# EAGLE schematic v1 (EAGLE 7.5.0)
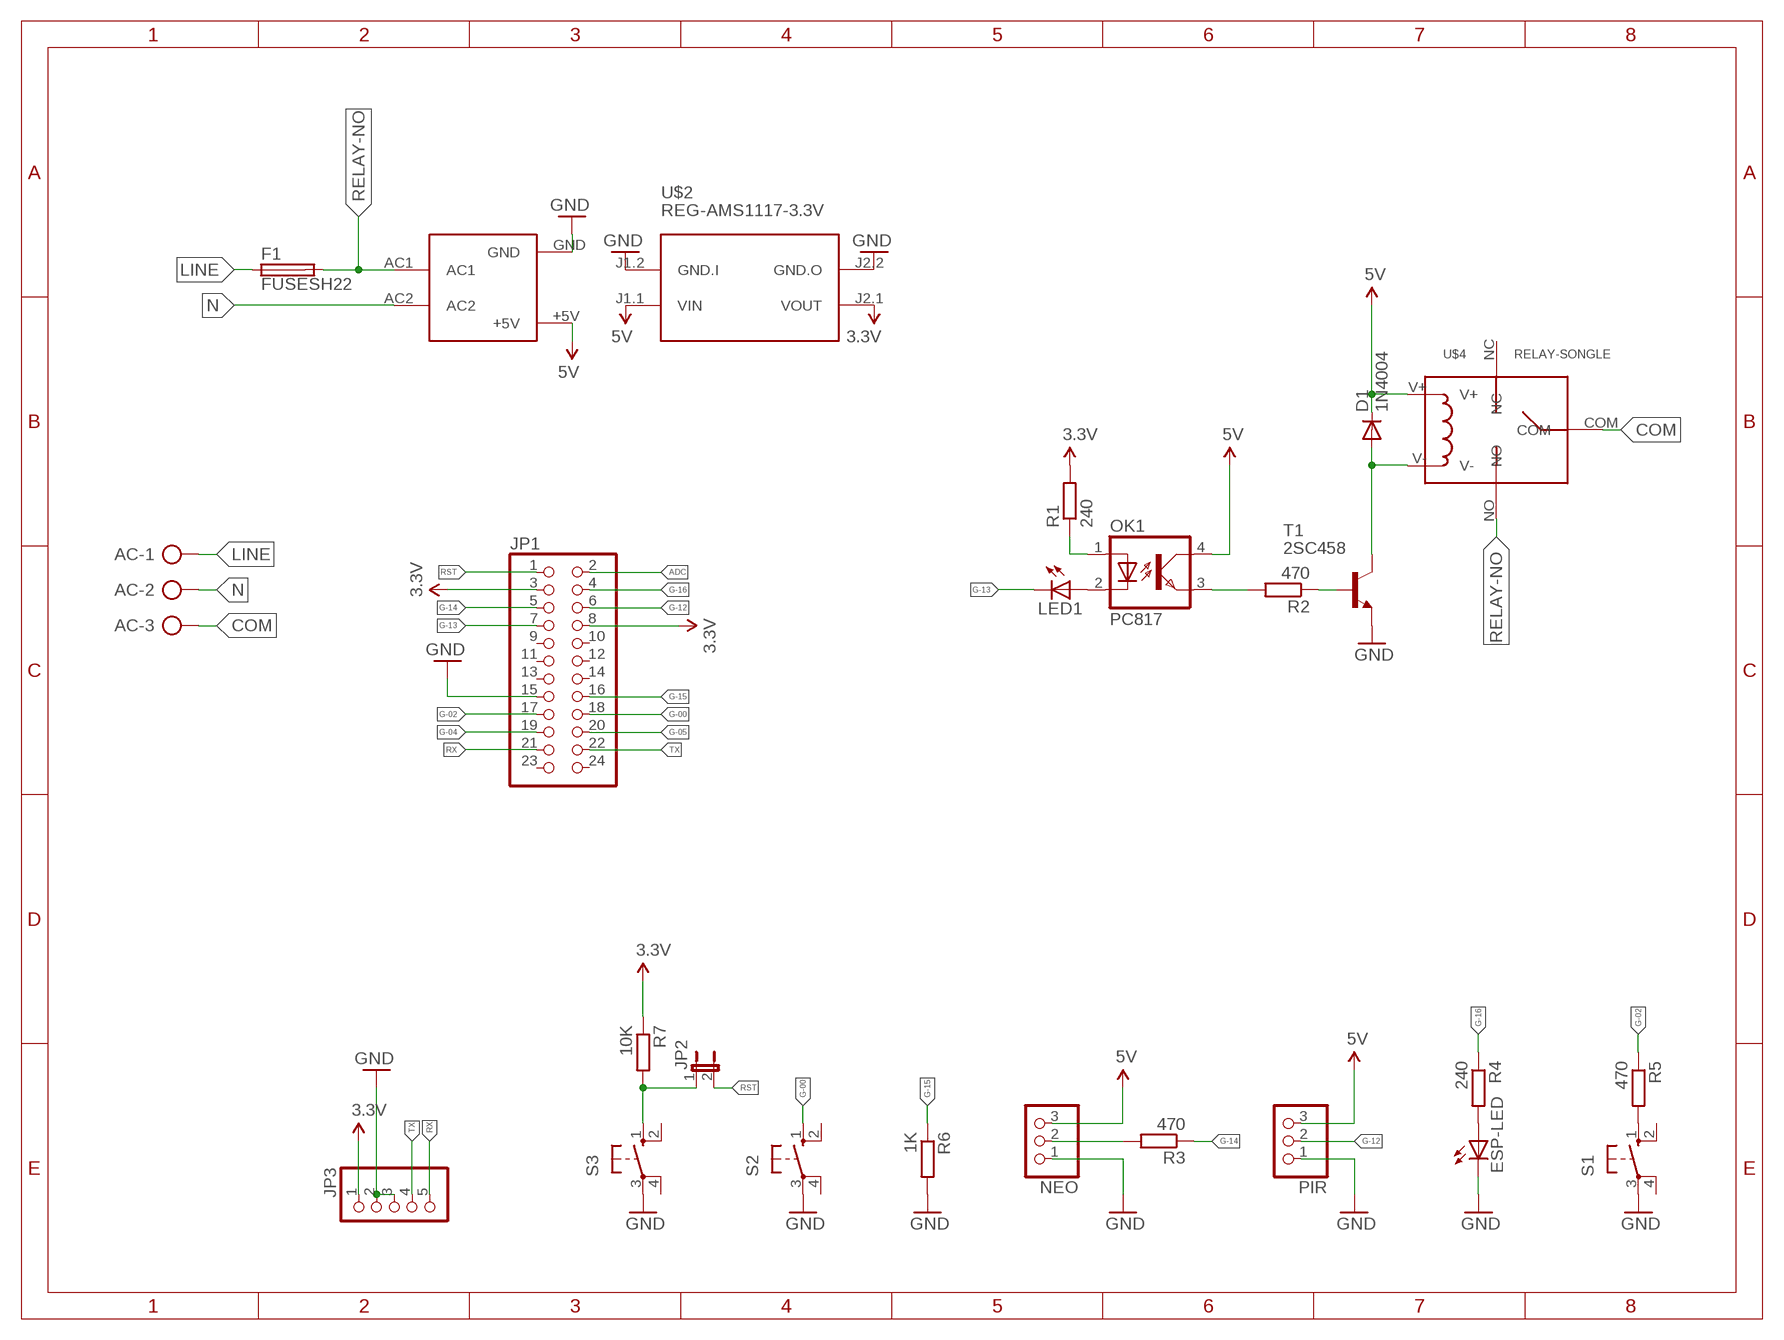
[diagram p0: schematic, sheet 1]

## Parts
AC  AK300/3  [AK300/3]
D1  1N4004  [DO41-10]
ESP-LED  LED5MM  [LED5MM]
F1  FUSESH22  [SH22]
JP1  PINHD-2X12  [2X12]
JP2  JUMPER-2PTH  [1X02]
JP3  PINHD-1X5  [1X05]
LED1  LED5MM  [LED5MM]
NEO  PINHD-1X3  [1X03]
OK1  PC817  [DIL04]
PIR  PINHD-1X3  [1X03]
R1  240  R-EU_0204/5  [0204/5]
R2  470  R-EU_0204/5  [0204/5]
R3  470  R-EU_0204/5  [0204/5]
R4  240  R-EU_0204/5  [0204/5]
R5  470  R-EU_0204/5  [0204/5]
R6  1K  R-EU_0204/5  [0204/5]
R7  10K  R-EU_0204/5  [0204/5]
S1  10-XX  [B3F-10XX]
S2  10-XX  [B3F-10XX]
S3  10-XX  [B3F-10XX]
T1  2SC458  [TO92-ECB]
U$1  HLK-PM01  [HLK-PM01]
U$2  REG-AMS1117-3.3V  [REG-AMS1117]
U$4  RELAY-SONGLE  [RELAY-SONGLE]

## Nets
3.3V: JP1.3 JP1.8 JP3.1 R1.2 R7.1 U$2.J2.1(VOUT)
5V: D1.C NEO.3 OK1.4(COL) PIR.3 U$1.+5V U$2.J1.1(VIN) U$4.V+
ADC: JP1.2
COM: AC.3 U$4.COM
G-00: JP1.18 S2.1(S)
G-02: JP1.17 R5.1
G-04: JP1.19
G-05: JP1.20
G-12: JP1.6 PIR.2
G-13: JP1.7 LED1.K(C)
G-14: JP1.5 R3.1
G-15: JP1.16 R6.1
G-16: JP1.4 R4.1
GND: ESP-LED.K(C) JP1.15 JP3.2 JP3.3 NEO.1 PIR.1 R6.2 S1.3(P) S2.3(P) S3.3(P) T1.E U$1.GND U$2.J1.2(GND.I) U$2.J2.2(GND.O)
LINE: AC.1 F1.1
N: AC.2 U$1.AC2
N$1: LED1.A OK1.2(C)
N$2: OK1.1(A) R1.1
N$3: OK1.3(EMIT) R2.2
N$4: R2.1 T1.B
N$5: D1.A T1.C U$4.V-
N$6: NEO.2 R3.2
N$7: R5.2 S1.1(S)
N$8: ESP-LED.A R4.2
N$9: JP2.1 R7.2 S3.1(S)
RELAY-NO: F1.2 U$1.AC1 U$4.NO
RST: JP1.1 JP2.2
RX: JP1.21 JP3.5
TX: JP1.22 JP3.4
Unconnected: JP1.9 JP1.10 JP1.11 JP1.12 JP1.13 JP1.14 JP1.23 JP1.24 S1.2(S1) S1.4(P1) S2.2(S1) S2.4(P1) S3.2(S1) S3.4(P1) U$4.NC

## Library data of the parts
AC = con-ptr500:AK300/3: CONNECTOR; OC_FARNELL: unknown; OC_NEWARK: unknown
D1 = diode:1N4004: DIODE general purpose rectifier, 1 A
ESP-LED LED1 = led:LED: LED OSRAM: - CHIPLED LG R971, LG N971, LY N971, LG Q971, LY Q971, LO R971, LY R971 LH N974, LH R974 LS Q976, LO Q976, LY Q976 LO Q996 - Hyper CHIPLED LW Q18S LB Q993, LB Q99A, LB R99A - SideLED LS A670, LO A670, LY A670, LG A670, LP A670 LB A673, LV A673, LT A673, LW A673 LH A674 LY A675 LS A676, LA A676, LO A676, LY A676, LW A676 LS A679, LY A679, LG A679 - Hyper Micro SIDELED® LS Y876, LA Y876, LO Y876, LY Y876 LT Y87S - SmartLED LW L88C, LW L88S LB L89C, LB L89S, LG L890 LS L89K, LO L89K, LY L89K LS L896, LA L896, LO L896, LY L896 - TOPLED LS T670, LO T670, LY T670, LG T670, LP T670 LSG T670, LSP T670, LSY T670, LOP T670, LYG T670 LG T671, LOG T671, LSG T671 LB T673, LV T673, LT T673, LW T673 LH T674 LS T676, LA T676, LO T676, LY T676, LB T676, LH T676, LSB T676, LW T676 LB T67C, LV T67C, LT T67C, LS T67K, LO T67K, LY T67K, LW E67C LS E67B, LA E67B, LO E67B, LY E67B, LB E67C, LV E67C, LT E67C LW T67C LS T679, LY T679, LG T679 LS T770, LO T770, LY T770, LG T770, LP T770 LB T773, LV T773, LT T773, LW T773 LH T774 LS E675, LA E675, LY E675, LS T675 LS T776, LA T776, LO T776, LY T776, LB T776 LHGB T686 LT T68C, LB T68C - Hyper Mini TOPLED® LB M676 - Mini TOPLED Santana® LG M470 LS M47K, LO M47K, LY M47K Source: http://www.osram.convergy.de LUXEON: - LUMILED® LXK2-PW12-R00, LXK2-PW12-S00, LXK2-PW14-U00, LXK2-PW14-V00 LXK2-PM12-R00, LXK2-PM12-S00, LXK2-PM14-U00 LXK2-PE12-Q00, LXK2-PE12-R00, LXK2-PE12-S00, LXK2-PE14-T00, LXK2-PE14-U00 LXK2-PB12-K00, LXK2-PB12-L00, LXK2-PB12-M00, LXK2-PB14-N00, LXK2-PB14-P00, LXK2-PB14-Q00 LXK2-PR12-L00, LXK2-PR12-M00, LXK2-PR14-Q00, LXK2-PR14-R00 LXK2-PD12-Q00, LXK2-PD12-R00, LXK2-PD12-S00 LXK2-PH12-R00, LXK2-PH12-S00 LXK2-PL12-P00, LXK2-PL12-Q00, LXK2-PL12-R00 Source: www.luxeon.com KINGBRIGHT: KA-3528ASYC Source: www.kingbright.com
F1 = fuse:FUSE: Fuse; OC_FARNELL: unknown; OC_NEWARK: unknown
JP1 = pinhead:PINHD-2X12: PIN HEADER
JP2 = SparkFun-Retired:JUMPER-2: Jumper Basic 0.1" spaced jumper. Use with breakaway headers.
JP3 = pinhead:PINHD-1X5: PIN HEADER
NEO PIR = pinhead:PINHD-1X3: PIN HEADER
OK1 = optocoupler:PC817: SHARP OPTO COUPLER; MPN: PC817X4J000F; OC_FARNELL: 9707727; OC_NEWARK: 97K7059
R1-R7 = rcl:R-EU_: RESISTOR, European symbol
S1-S3 = switch-omron:10-XX: OMRON SWITCH; MPN: B3F-1000; OC_FARNELL: 176432; OC_NEWARK: 36M3542
T1 = transistor:2SC458: NPN Silicon Epitaxial Planar Transistor Source: SEMTECH ELECTRONICS LTD. ... 2SC458 1.pdf
U$1 = HLK-PM01:HLK-PM01
U$2 = DIY-Modules:REG-AMS1117-*: Linear Regulator based on AMS1117 chip
U$4 = Seeed-OPL-Relay:RELAY-SONGLE